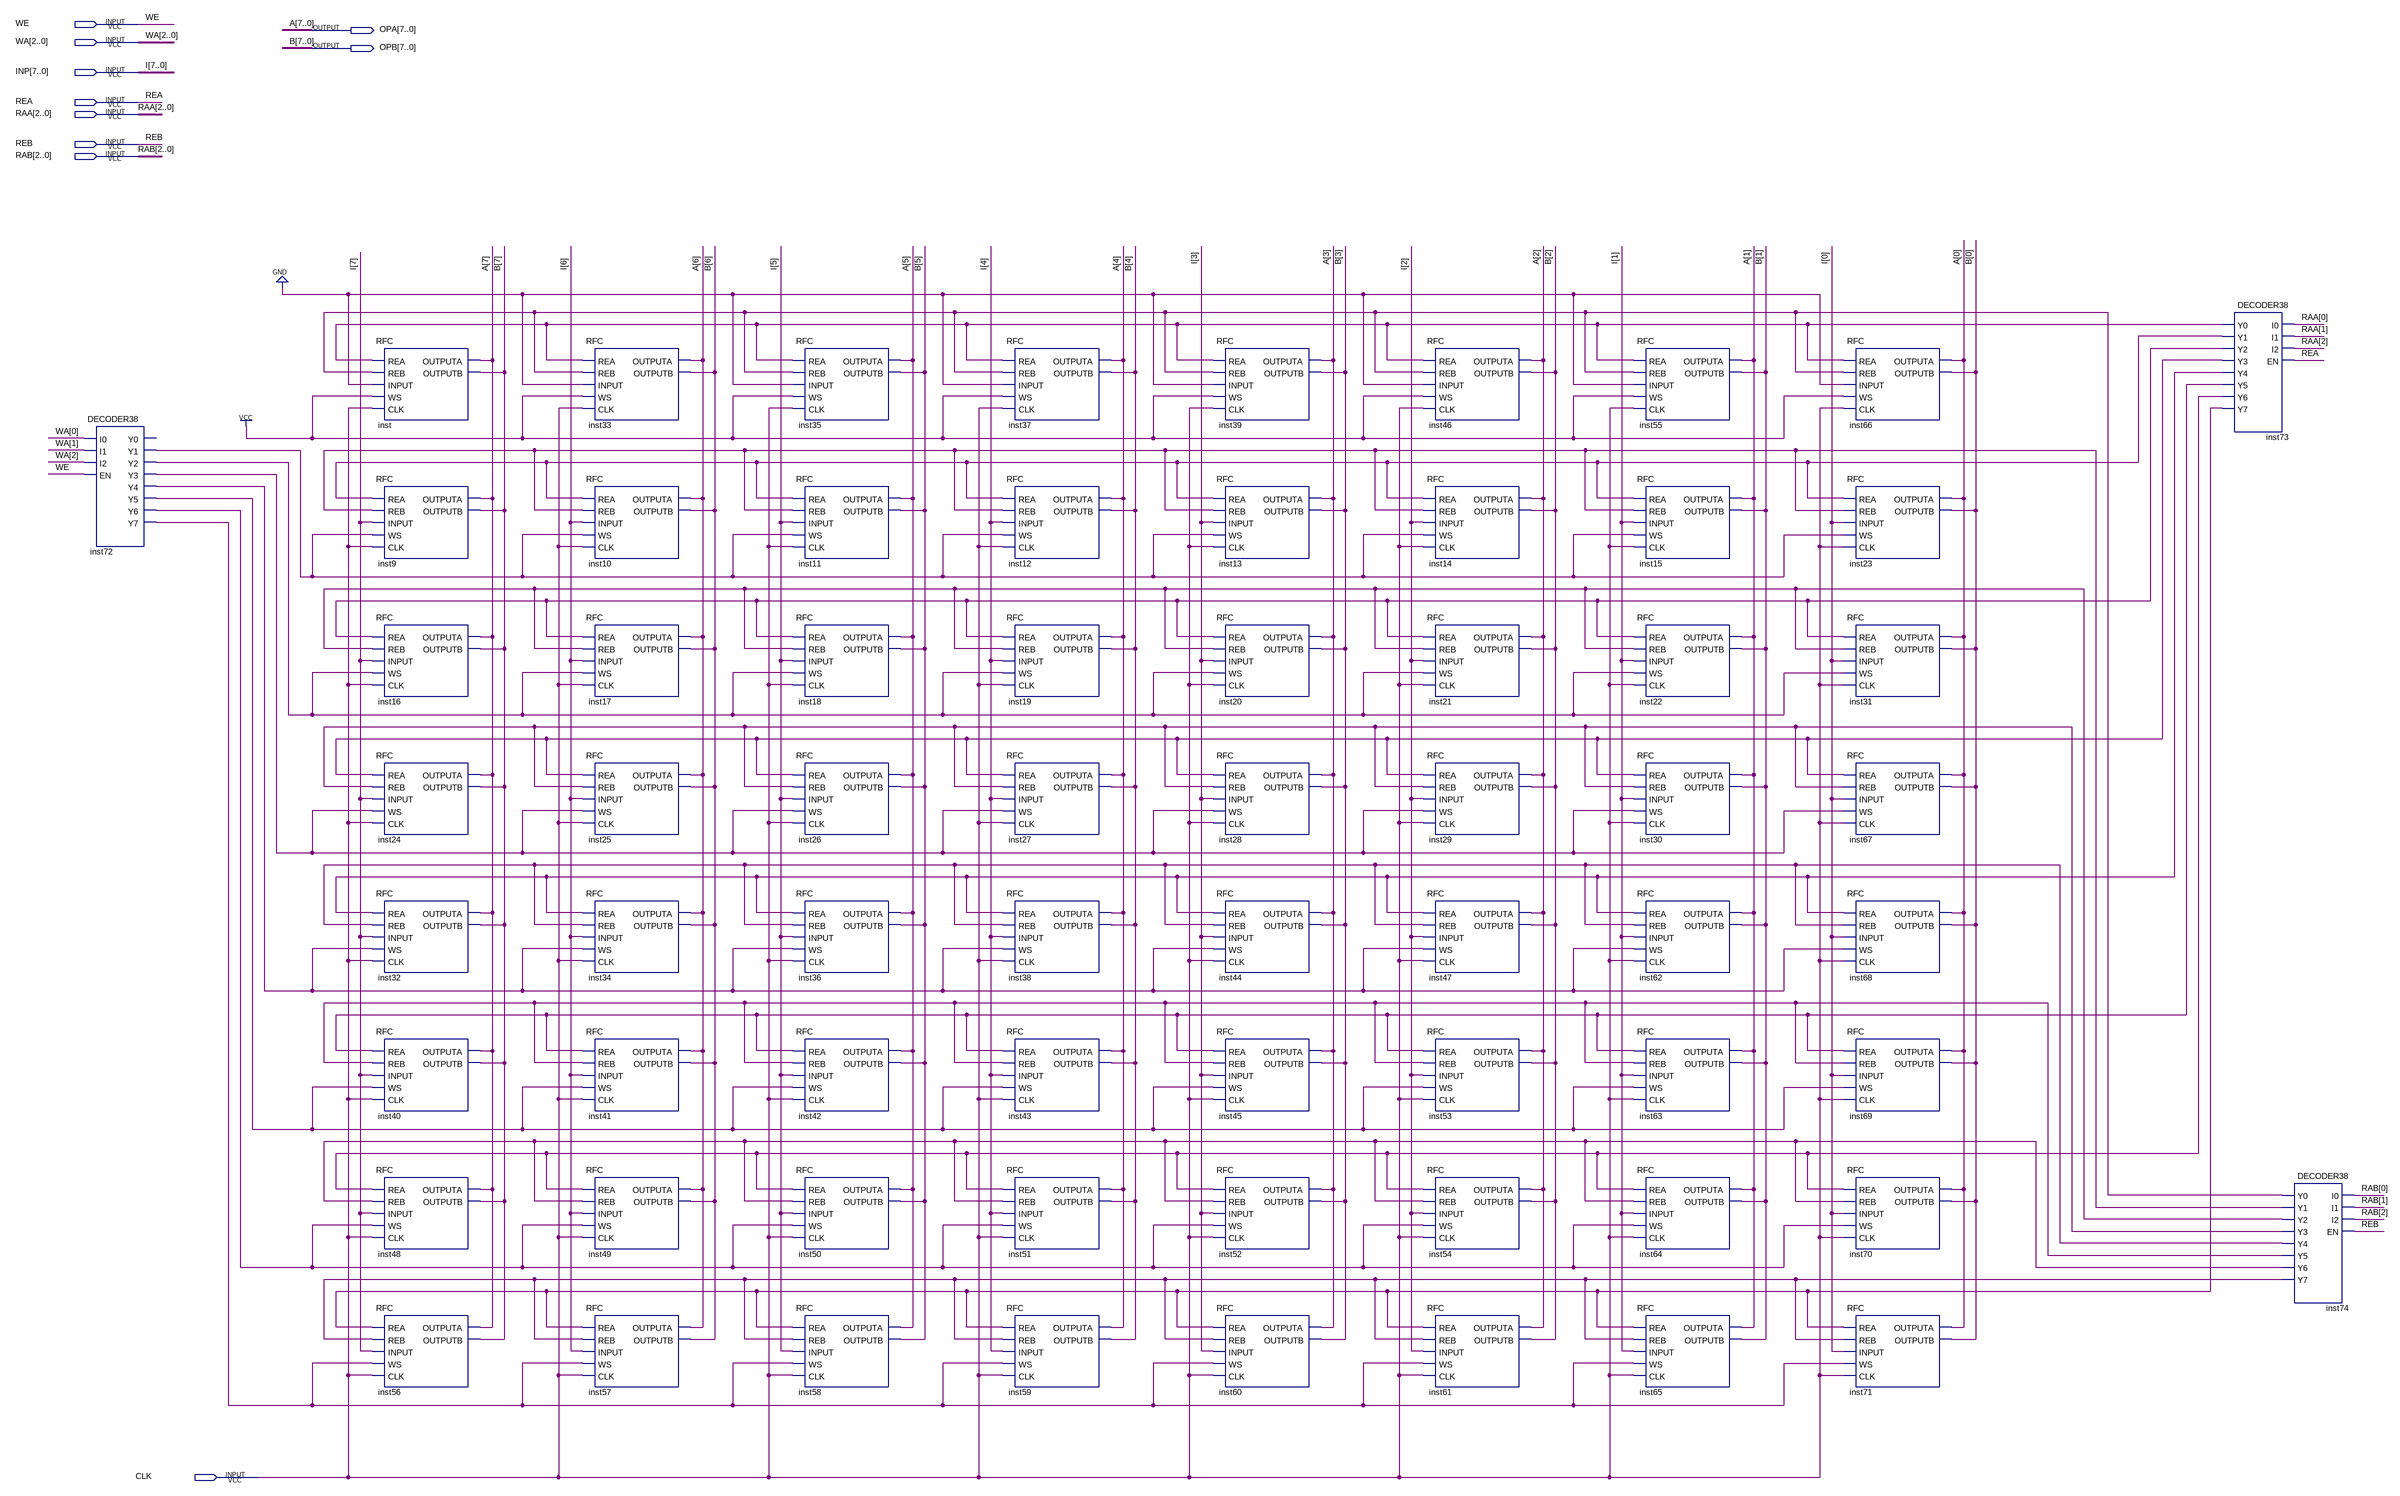
[diagram p0: schematic sheet]
// Quartus schematic RF88.bdf as structural Verilog: 67 symbols, 10 pins
module RF88 (
  input  WE,
  input  [2:0] WA,
  input  [7:0] INP,
  input  REA,
  input  [2:0] RAA,
  input  REB,
  input  [2:0] RAB,
  input  CLK,
  output [7:0] OPA,
  output [7:0] OPB
);

  wire inst72_y1, inst72_y2, inst72_y3, inst72_y4, inst72_y5, inst72_y6, inst72_y7, inst73_y0, inst73_y1,
       inst73_y2, inst73_y3, inst73_y4, inst73_y5, inst73_y6, inst73_y7, inst74_y0, inst74_y1, inst74_y2,
       inst74_y3, inst74_y4, inst74_y5, inst74_y6, inst74_y7;

  DECODER38 inst72 (
    .I0(WA[0]), .I1(WA[1]), .I2(WA[2]), .EN(WE), .Y1(inst72_y1), .Y2(inst72_y2), .Y3(inst72_y3),
    .Y4(inst72_y4), .Y5(inst72_y5), .Y6(inst72_y6), .Y7(inst72_y7));  // open: Y0
  RFC inst (.REA(inst73_y0), .REB(inst74_y0), .INPUT(1'b0), .WS(1'b1), .CLK(CLK), .OUTPUTA(OPA[7]), .OUTPUTB(OPB[7]));
  RFC inst9 (
    .REA(inst73_y1), .REB(inst74_y1), .INPUT(INP[7]), .WS(inst72_y1), .CLK(CLK), .OUTPUTA(OPA[7]),
    .OUTPUTB(OPB[7]));
  RFC inst16 (
    .REA(inst73_y2), .REB(inst74_y2), .INPUT(INP[7]), .WS(inst72_y2), .CLK(CLK), .OUTPUTA(OPA[7]),
    .OUTPUTB(OPB[7]));
  RFC inst24 (
    .REA(inst73_y3), .REB(inst74_y3), .INPUT(INP[7]), .WS(inst72_y3), .CLK(CLK), .OUTPUTA(OPA[7]),
    .OUTPUTB(OPB[7]));
  RFC inst32 (
    .REA(inst73_y4), .REB(inst74_y4), .INPUT(INP[7]), .WS(inst72_y4), .CLK(CLK), .OUTPUTA(OPA[7]),
    .OUTPUTB(OPB[7]));
  RFC inst40 (
    .REA(inst73_y5), .REB(inst74_y5), .INPUT(INP[7]), .WS(inst72_y5), .CLK(CLK), .OUTPUTA(OPA[7]),
    .OUTPUTB(OPB[7]));
  RFC inst48 (
    .REA(inst73_y6), .REB(inst74_y6), .INPUT(INP[7]), .WS(inst72_y6), .CLK(CLK), .OUTPUTA(OPA[7]),
    .OUTPUTB(OPB[7]));
  RFC inst56 (
    .REA(inst73_y7), .REB(inst74_y7), .INPUT(INP[7]), .WS(inst72_y7), .CLK(CLK), .OUTPUTA(OPA[7]),
    .OUTPUTB(OPB[7]));
  RFC inst33 (.REA(inst73_y0), .REB(inst74_y0), .INPUT(1'b0), .WS(1'b1), .CLK(CLK), .OUTPUTA(OPA[6]), .OUTPUTB(OPB[6]));
  RFC inst10 (
    .REA(inst73_y1), .REB(inst74_y1), .INPUT(INP[6]), .WS(inst72_y1), .CLK(CLK), .OUTPUTA(OPA[6]),
    .OUTPUTB(OPB[6]));
  RFC inst17 (
    .REA(inst73_y2), .REB(inst74_y2), .INPUT(INP[6]), .WS(inst72_y2), .CLK(CLK), .OUTPUTA(OPA[6]),
    .OUTPUTB(OPB[6]));
  RFC inst25 (
    .REA(inst73_y3), .REB(inst74_y3), .INPUT(INP[6]), .WS(inst72_y3), .CLK(CLK), .OUTPUTA(OPA[6]),
    .OUTPUTB(OPB[6]));
  RFC inst34 (
    .REA(inst73_y4), .REB(inst74_y4), .INPUT(INP[6]), .WS(inst72_y4), .CLK(CLK), .OUTPUTA(OPA[6]),
    .OUTPUTB(OPB[6]));
  RFC inst41 (
    .REA(inst73_y5), .REB(inst74_y5), .INPUT(INP[6]), .WS(inst72_y5), .CLK(CLK), .OUTPUTA(OPA[6]),
    .OUTPUTB(OPB[6]));
  RFC inst49 (
    .REA(inst73_y6), .REB(inst74_y6), .INPUT(INP[6]), .WS(inst72_y6), .CLK(CLK), .OUTPUTA(OPA[6]),
    .OUTPUTB(OPB[6]));
  RFC inst57 (
    .REA(inst73_y7), .REB(inst74_y7), .INPUT(INP[6]), .WS(inst72_y7), .CLK(CLK), .OUTPUTA(OPA[6]),
    .OUTPUTB(OPB[6]));
  RFC inst35 (.REA(inst73_y0), .REB(inst74_y0), .INPUT(1'b0), .WS(1'b1), .CLK(CLK), .OUTPUTA(OPA[5]), .OUTPUTB(OPB[5]));
  RFC inst11 (
    .REA(inst73_y1), .REB(inst74_y1), .INPUT(INP[5]), .WS(inst72_y1), .CLK(CLK), .OUTPUTA(OPA[5]),
    .OUTPUTB(OPB[5]));
  RFC inst18 (
    .REA(inst73_y2), .REB(inst74_y2), .INPUT(INP[5]), .WS(inst72_y2), .CLK(CLK), .OUTPUTA(OPA[5]),
    .OUTPUTB(OPB[5]));
  RFC inst26 (
    .REA(inst73_y3), .REB(inst74_y3), .INPUT(INP[5]), .WS(inst72_y3), .CLK(CLK), .OUTPUTA(OPA[5]),
    .OUTPUTB(OPB[5]));
  RFC inst36 (
    .REA(inst73_y4), .REB(inst74_y4), .INPUT(INP[5]), .WS(inst72_y4), .CLK(CLK), .OUTPUTA(OPA[5]),
    .OUTPUTB(OPB[5]));
  RFC inst42 (
    .REA(inst73_y5), .REB(inst74_y5), .INPUT(INP[5]), .WS(inst72_y5), .CLK(CLK), .OUTPUTA(OPA[5]),
    .OUTPUTB(OPB[5]));
  RFC inst50 (
    .REA(inst73_y6), .REB(inst74_y6), .INPUT(INP[5]), .WS(inst72_y6), .CLK(CLK), .OUTPUTA(OPA[5]),
    .OUTPUTB(OPB[5]));
  RFC inst58 (
    .REA(inst73_y7), .REB(inst74_y7), .INPUT(INP[5]), .WS(inst72_y7), .CLK(CLK), .OUTPUTA(OPA[5]),
    .OUTPUTB(OPB[5]));
  RFC inst37 (.REA(inst73_y0), .REB(inst74_y0), .INPUT(1'b0), .WS(1'b1), .CLK(CLK), .OUTPUTA(OPA[4]), .OUTPUTB(OPB[4]));
  RFC inst12 (
    .REA(inst73_y1), .REB(inst74_y1), .INPUT(INP[4]), .WS(inst72_y1), .CLK(CLK), .OUTPUTA(OPA[4]),
    .OUTPUTB(OPB[4]));
  RFC inst19 (
    .REA(inst73_y2), .REB(inst74_y2), .INPUT(INP[4]), .WS(inst72_y2), .CLK(CLK), .OUTPUTA(OPA[4]),
    .OUTPUTB(OPB[4]));
  RFC inst27 (
    .REA(inst73_y3), .REB(inst74_y3), .INPUT(INP[4]), .WS(inst72_y3), .CLK(CLK), .OUTPUTA(OPA[4]),
    .OUTPUTB(OPB[4]));
  RFC inst38 (
    .REA(inst73_y4), .REB(inst74_y4), .INPUT(INP[4]), .WS(inst72_y4), .CLK(CLK), .OUTPUTA(OPA[4]),
    .OUTPUTB(OPB[4]));
  RFC inst43 (
    .REA(inst73_y5), .REB(inst74_y5), .INPUT(INP[4]), .WS(inst72_y5), .CLK(CLK), .OUTPUTA(OPA[4]),
    .OUTPUTB(OPB[4]));
  RFC inst51 (
    .REA(inst73_y6), .REB(inst74_y6), .INPUT(INP[4]), .WS(inst72_y6), .CLK(CLK), .OUTPUTA(OPA[4]),
    .OUTPUTB(OPB[4]));
  RFC inst59 (
    .REA(inst73_y7), .REB(inst74_y7), .INPUT(INP[4]), .WS(inst72_y7), .CLK(CLK), .OUTPUTA(OPA[4]),
    .OUTPUTB(OPB[4]));
  RFC inst39 (.REA(inst73_y0), .REB(inst74_y0), .INPUT(1'b0), .WS(1'b1), .CLK(CLK), .OUTPUTA(OPA[3]), .OUTPUTB(OPB[3]));
  RFC inst13 (
    .REA(inst73_y1), .REB(inst74_y1), .INPUT(INP[3]), .WS(inst72_y1), .CLK(CLK), .OUTPUTA(OPA[3]),
    .OUTPUTB(OPB[3]));
  RFC inst20 (
    .REA(inst73_y2), .REB(inst74_y2), .INPUT(INP[3]), .WS(inst72_y2), .CLK(CLK), .OUTPUTA(OPA[3]),
    .OUTPUTB(OPB[3]));
  RFC inst28 (
    .REA(inst73_y3), .REB(inst74_y3), .INPUT(INP[3]), .WS(inst72_y3), .CLK(CLK), .OUTPUTA(OPA[3]),
    .OUTPUTB(OPB[3]));
  RFC inst44 (
    .REA(inst73_y4), .REB(inst74_y4), .INPUT(INP[3]), .WS(inst72_y4), .CLK(CLK), .OUTPUTA(OPA[3]),
    .OUTPUTB(OPB[3]));
  RFC inst45 (
    .REA(inst73_y5), .REB(inst74_y5), .INPUT(INP[3]), .WS(inst72_y5), .CLK(CLK), .OUTPUTA(OPA[3]),
    .OUTPUTB(OPB[3]));
  RFC inst52 (
    .REA(inst73_y6), .REB(inst74_y6), .INPUT(INP[3]), .WS(inst72_y6), .CLK(CLK), .OUTPUTA(OPA[3]),
    .OUTPUTB(OPB[3]));
  RFC inst60 (
    .REA(inst73_y7), .REB(inst74_y7), .INPUT(INP[3]), .WS(inst72_y7), .CLK(CLK), .OUTPUTA(OPA[3]),
    .OUTPUTB(OPB[3]));
  RFC inst46 (.REA(inst73_y0), .REB(inst74_y0), .INPUT(1'b0), .WS(1'b1), .CLK(CLK), .OUTPUTA(OPA[2]), .OUTPUTB(OPB[2]));
  RFC inst14 (
    .REA(inst73_y1), .REB(inst74_y1), .INPUT(INP[2]), .WS(inst72_y1), .CLK(CLK), .OUTPUTA(OPA[2]),
    .OUTPUTB(OPB[2]));
  RFC inst21 (
    .REA(inst73_y2), .REB(inst74_y2), .INPUT(INP[2]), .WS(inst72_y2), .CLK(CLK), .OUTPUTA(OPA[2]),
    .OUTPUTB(OPB[2]));
  RFC inst29 (
    .REA(inst73_y3), .REB(inst74_y3), .INPUT(INP[2]), .WS(inst72_y3), .CLK(CLK), .OUTPUTA(OPA[2]),
    .OUTPUTB(OPB[2]));
  RFC inst47 (
    .REA(inst73_y4), .REB(inst74_y4), .INPUT(INP[2]), .WS(inst72_y4), .CLK(CLK), .OUTPUTA(OPA[2]),
    .OUTPUTB(OPB[2]));
  RFC inst53 (
    .REA(inst73_y5), .REB(inst74_y5), .INPUT(INP[2]), .WS(inst72_y5), .CLK(CLK), .OUTPUTA(OPA[2]),
    .OUTPUTB(OPB[2]));
  RFC inst54 (
    .REA(inst73_y6), .REB(inst74_y6), .INPUT(INP[2]), .WS(inst72_y6), .CLK(CLK), .OUTPUTA(OPA[2]),
    .OUTPUTB(OPB[2]));
  RFC inst61 (
    .REA(inst73_y7), .REB(inst74_y7), .INPUT(INP[2]), .WS(inst72_y7), .CLK(CLK), .OUTPUTA(OPA[2]),
    .OUTPUTB(OPB[2]));
  RFC inst55 (.REA(inst73_y0), .REB(inst74_y0), .INPUT(1'b0), .WS(1'b1), .CLK(CLK), .OUTPUTA(OPA[1]), .OUTPUTB(OPB[1]));
  RFC inst15 (
    .REA(inst73_y1), .REB(inst74_y1), .INPUT(INP[1]), .WS(inst72_y1), .CLK(CLK), .OUTPUTA(OPA[1]),
    .OUTPUTB(OPB[1]));
  RFC inst22 (
    .REA(inst73_y2), .REB(inst74_y2), .INPUT(INP[1]), .WS(inst72_y2), .CLK(CLK), .OUTPUTA(OPA[1]),
    .OUTPUTB(OPB[1]));
  RFC inst30 (
    .REA(inst73_y3), .REB(inst74_y3), .INPUT(INP[1]), .WS(inst72_y3), .CLK(CLK), .OUTPUTA(OPA[1]),
    .OUTPUTB(OPB[1]));
  RFC inst62 (
    .REA(inst73_y4), .REB(inst74_y4), .INPUT(INP[1]), .WS(inst72_y4), .CLK(CLK), .OUTPUTA(OPA[1]),
    .OUTPUTB(OPB[1]));
  RFC inst63 (
    .REA(inst73_y5), .REB(inst74_y5), .INPUT(INP[1]), .WS(inst72_y5), .CLK(CLK), .OUTPUTA(OPA[1]),
    .OUTPUTB(OPB[1]));
  RFC inst64 (
    .REA(inst73_y6), .REB(inst74_y6), .INPUT(INP[1]), .WS(inst72_y6), .CLK(CLK), .OUTPUTA(OPA[1]),
    .OUTPUTB(OPB[1]));
  RFC inst65 (
    .REA(inst73_y7), .REB(inst74_y7), .INPUT(INP[1]), .WS(inst72_y7), .CLK(CLK), .OUTPUTA(OPA[1]),
    .OUTPUTB(OPB[1]));
  RFC inst66 (.REA(inst73_y0), .REB(inst74_y0), .INPUT(1'b0), .WS(1'b1), .CLK(CLK), .OUTPUTA(OPA[0]), .OUTPUTB(OPB[0]));
  RFC inst23 (
    .REA(inst73_y1), .REB(inst74_y1), .INPUT(INP[0]), .WS(inst72_y1), .CLK(CLK), .OUTPUTA(OPA[0]),
    .OUTPUTB(OPB[0]));
  RFC inst31 (
    .REA(inst73_y2), .REB(inst74_y2), .INPUT(INP[0]), .WS(inst72_y2), .CLK(CLK), .OUTPUTA(OPA[0]),
    .OUTPUTB(OPB[0]));
  RFC inst67 (
    .REA(inst73_y3), .REB(inst74_y3), .INPUT(INP[0]), .WS(inst72_y3), .CLK(CLK), .OUTPUTA(OPA[0]),
    .OUTPUTB(OPB[0]));
  RFC inst68 (
    .REA(inst73_y4), .REB(inst74_y4), .INPUT(INP[0]), .WS(inst72_y4), .CLK(CLK), .OUTPUTA(OPA[0]),
    .OUTPUTB(OPB[0]));
  RFC inst69 (
    .REA(inst73_y5), .REB(inst74_y5), .INPUT(INP[0]), .WS(inst72_y5), .CLK(CLK), .OUTPUTA(OPA[0]),
    .OUTPUTB(OPB[0]));
  RFC inst70 (
    .REA(inst73_y6), .REB(inst74_y6), .INPUT(INP[0]), .WS(inst72_y6), .CLK(CLK), .OUTPUTA(OPA[0]),
    .OUTPUTB(OPB[0]));
  RFC inst71 (
    .REA(inst73_y7), .REB(inst74_y7), .INPUT(INP[0]), .WS(inst72_y7), .CLK(CLK), .OUTPUTA(OPA[0]),
    .OUTPUTB(OPB[0]));
  DECODER38 inst73 (
    .I0(RAA[0]), .I1(RAA[1]), .I2(RAA[2]), .EN(REA), .Y0(inst73_y0), .Y1(inst73_y1), .Y2(inst73_y2),
    .Y3(inst73_y3), .Y4(inst73_y4), .Y5(inst73_y5), .Y6(inst73_y6), .Y7(inst73_y7));
  DECODER38 inst74 (
    .I0(RAB[0]), .I1(RAB[1]), .I2(RAB[2]), .EN(REB), .Y0(inst74_y0), .Y1(inst74_y1), .Y2(inst74_y2),
    .Y3(inst74_y3), .Y4(inst74_y4), .Y5(inst74_y5), .Y6(inst74_y6), .Y7(inst74_y7));

  // Other names for the same wires on the sheet: A[7:0] = OPA; B[7:0] = OPB; I[7:0] = INP
endmodule
